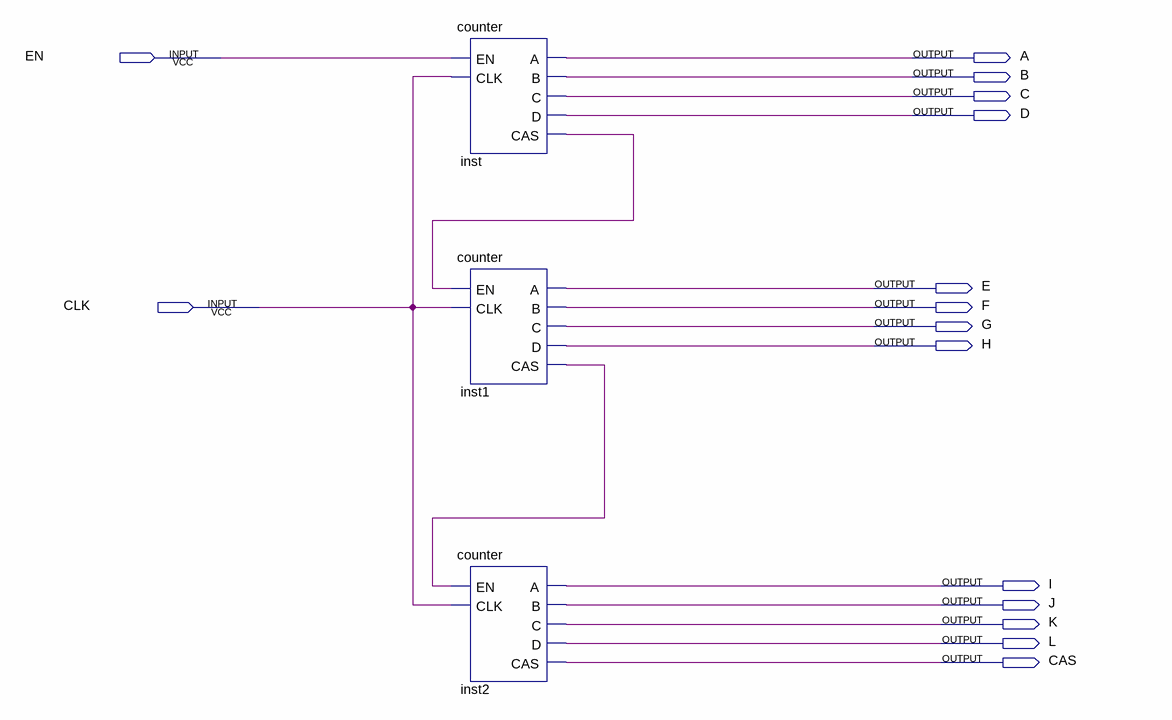
[diagram p0: schematic sheet]
// Quartus schematic sametime_counter_12bit.bdf as structural Verilog: 3 symbols, 15 pins
module sametime_counter_12bit (
  input  EN,
  input  CLK,
  output A,
  output B,
  output C,
  output D,
  output E,
  output F,
  output G,
  output H,
  output I,
  output J,
  output K,
  output L,
  output CAS
);

  wire inst1_cas, inst_cas;

  counter inst (.EN(EN), .CLK(CLK), .A(A), .B(B), .C(C), .D(D), .CAS(inst_cas));
  counter inst1 (.EN(inst_cas), .CLK(CLK), .A(E), .B(F), .C(G), .D(H), .CAS(inst1_cas));
  counter inst2 (.EN(inst1_cas), .CLK(CLK), .A(I), .B(J), .C(K), .D(L), .CAS(CAS));
endmodule
